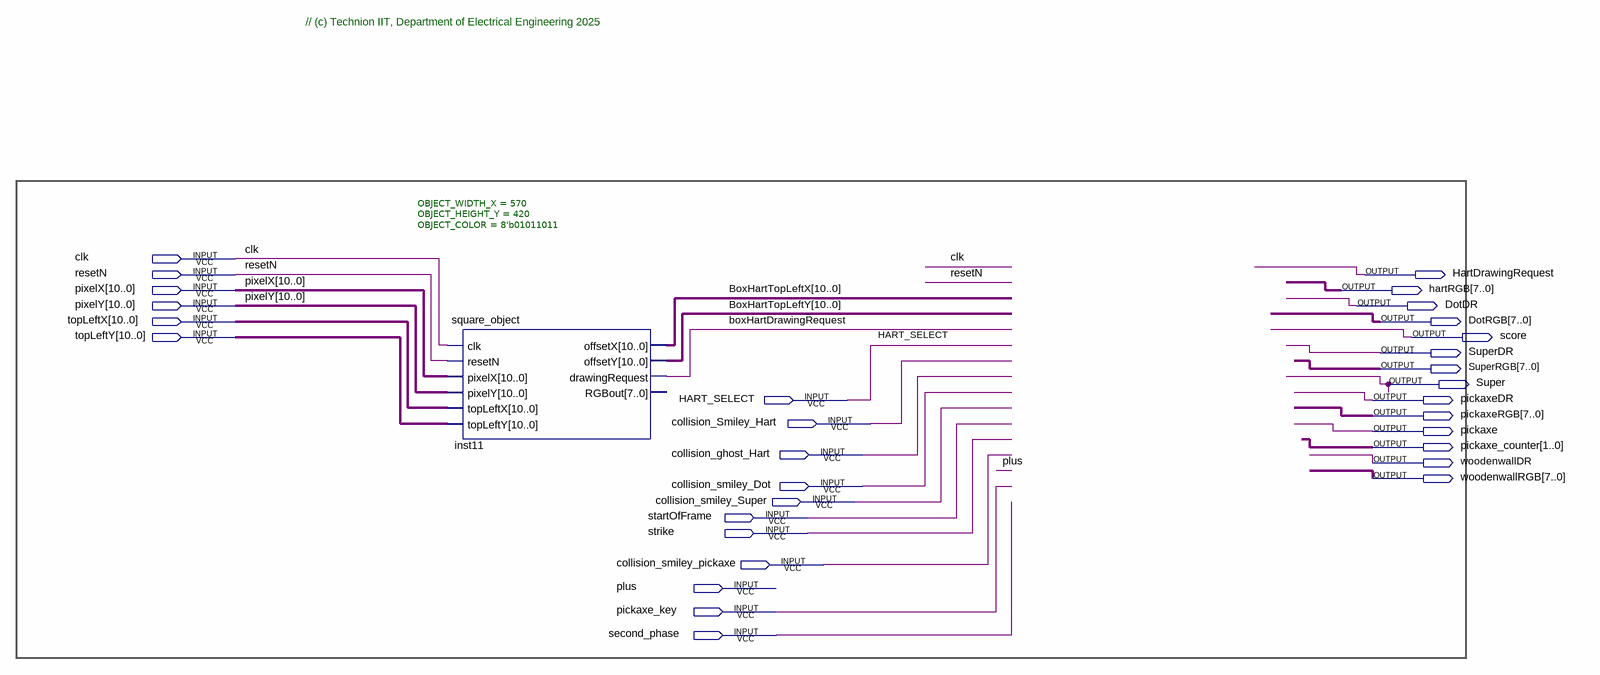
[diagram p0: schematic sheet]
// Quartus schematic HART_DISPLAY.bdf as structural Verilog: 1 symbols, 31 pins
module HART_DISPLAY (
  input  clk,
  input  resetN,
  input  [10:0] pixelX,
  input  [10:0] pixelY,
  input  [10:0] topLeftX,
  input  [10:0] topLeftY,
  input  HART_SELECT,
  input  collision_Smiley_Hart,
  input  collision_ghost_Hart,
  input  collision_smiley_Dot,
  input  collision_smiley_Super,
  input  startOfFrame,
  input  strike,
  input  collision_smiley_pickaxe,
  input  plus,
  input  pickaxe_key,
  input  second_phase,
  output HartDrawingRequest,
  output [7:0] hartRGB,
  output DotDR,
  output [7:0] DotRGB,
  output score,
  output SuperDR,
  output [7:0] SuperRGB,
  output Super,
  output pickaxeDR,
  output [7:0] pickaxeRGB,
  output pickaxe,
  output [1:0] pickaxe_counter,
  output woodenwallDR,
  output [7:0] woodenwallRGB
);

  wire boxHartDrawingRequest;
  wire [10:0] BoxHartTopLeftX, BoxHartTopLeftY;

  square_object #(.OBJECT_WIDTH_X(570), .OBJECT_HEIGHT_Y(420), .OBJECT_COLOR(8'b01011011)) inst11 (
    .clk(clk), .resetN(resetN), .pixelX(pixelX), .pixelY(pixelY), .topLeftX(topLeftX), .topLeftY(topLeftY),
    .offsetX(BoxHartTopLeftX), .offsetY(BoxHartTopLeftY), .drawingRequest(boxHartDrawingRequest));  // open: RGBout

  // Notes on the sheet:
  //   // (c) Technion IIT, Department of Electrical Engineering 2025
endmodule
